# Altium schematic sheet Sheet1.SCHDOC
size 420 x 297 mm; SheetNumber: 1; SheetTotal: 1; Scale: 1:1; DocumentType: Схема электрическая принципиальная; FirstReferrence: АБВГ.123456.001; DocumentName: Sheet1.SCHDOC
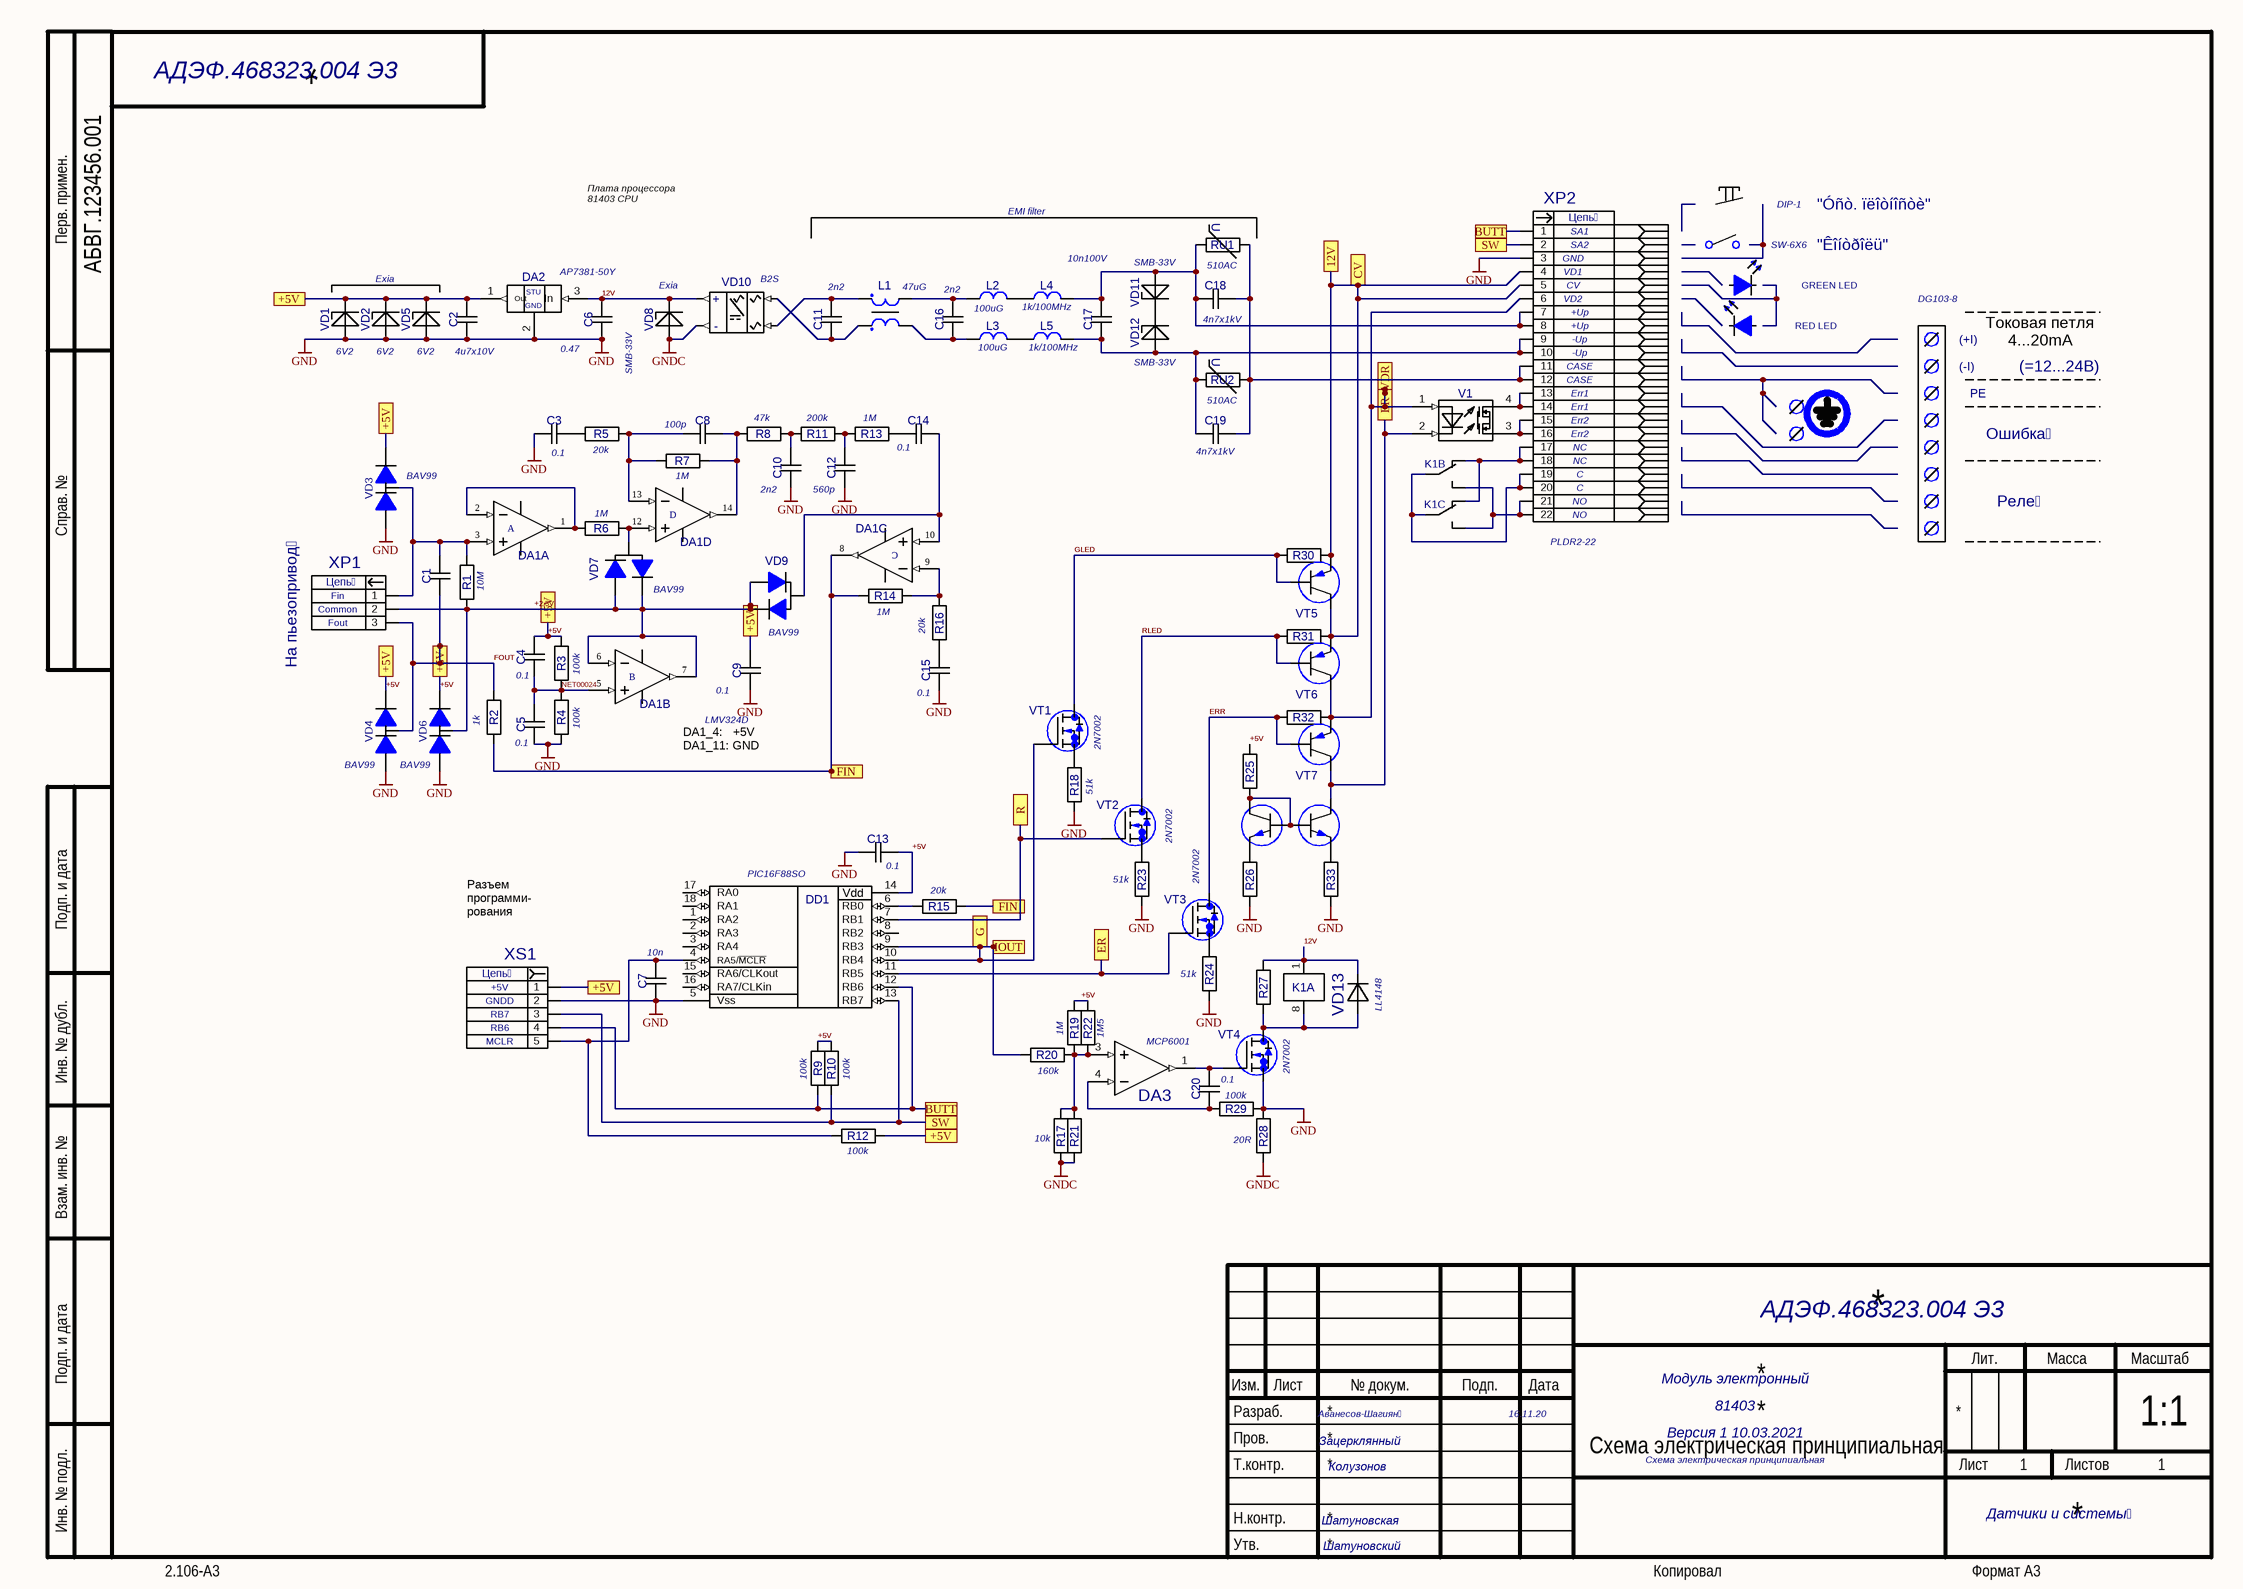
[diagram p0: Sheet1.SCHDOC]

## Parts
C1  CN0805  [0805]  (value not drawn)
C2  CN0805  [0805]  (value not drawn)
C3  CN0805  [0805]  (value not drawn)
C4  CN0805  [0805]  (value not drawn)
C5  CN0805  [0805]  (value not drawn)
C6  CN0805  [0805]  (value not drawn)
C7  CN0805  [0805]  (value not drawn)
C8  CN0805  [0805]  (value not drawn)
C9  CN0805  [0805]  (value not drawn)
C10  CN0805  [0805]  (value not drawn)
C11  CN0805  [0805]  (value not drawn)
C12  CN0805  [0805]  (value not drawn)
C13  CN0805  [0805]  (value not drawn)
C14  CN0805  [0805]  (value not drawn)
C15  CN0805  [0805]  (value not drawn)
C16  CN0805  [0805]  (value not drawn)
C17  CN0805  [0805]  (value not drawn)
C18  CN1210  [1210]  (value not drawn)
C19  CN1210  [1210]  (value not drawn)
C20  CN0805  [0805]  (value not drawn)
DA1  DA-OP-AD8544-SO14  [SO-G14]  (value not drawn)  (parts A,B,C,D of 4)
DA2  DA-STU-78LXXSOT89  [SOT89M]  (value not drawn)
DA3  DA-OP-AD8541-SOT23  [SOT23-(5)]  (value not drawn)
DD1  DD-CPU-PIC16F88SO  [SO18W]  (value not drawn)
K1  K-RELAY-UA2  [UB2]  (value not drawn)  (parts A,B,C of 3)
L1  L-SF0602  [SF0602]  (value not drawn)
L2  L-1210  [1210]  (value not drawn)
L3  L-1210  [1210]  (value not drawn)
L4  L-0805  [0805]  (value not drawn)
L5  L-0805  [0805]  (value not drawn)
R1  R1206  [1206]  (value not drawn)
R2  R1206  [1206]  (value not drawn)
R3  R1206  [1206]  (value not drawn)
R4  R1206  [1206]  (value not drawn)
R5  R1206  [1206]  (value not drawn)
R6  R1206  [1206]  (value not drawn)
R7  R1206  [1206]  (value not drawn)
R8  R1206  [1206]  (value not drawn)
R9  R1206  [1206]  (value not drawn)
R10  R1206  [1206]  (value not drawn)
R11  R1206  [1206]  (value not drawn)
R12  R1206  [1206]  (value not drawn)
R13  R1206  [1206]  (value not drawn)
R14  R1206  [1206]  (value not drawn)
R15  R1206  [1206]  (value not drawn)
R16  R1206  [1206]  (value not drawn)
R17  R1206  [1206]  (value not drawn)
R18  R1206  [1206]  (value not drawn)
R19  R1206  [1206]  (value not drawn)
R20  R1206  [1206]  (value not drawn)
R21  R1206  [1206]  (value not drawn)
R22  R1206  [1206]  (value not drawn)
R23  R1206  [1206]  (value not drawn)
R24  R1206  [1206]  (value not drawn)
R25  R1206  [1206]  (value not drawn)
R26  R1206  [1206]  (value not drawn)
R27  R1206  [1206]  (value not drawn)
R28  R1206  [1206]  (value not drawn)
R29  R1206  [1206]  (value not drawn)
R30  R1206  [1206]  (value not drawn)
R31  R1206  [1206]  (value not drawn)
R32  R1206  [1206]  (value not drawn)
R33  R1206  [1206]  (value not drawn)
RU1  RU-14D  [RU-14D]  (value not drawn)
RU2  RU-14D  [RU-14D]  (value not drawn)
V1  V-5P103V  [DIP_4_SMD]  (value not drawn)
VD1  VD-BZ-DO213AA  [DO-213AA]  (value not drawn)
VD2  VD-BZ-DO213AA  [DO-213AA]  (value not drawn)
VD3  VD-DIOD-BAV99V  [SOT23]  (value not drawn)
VD4  VD-DIOD-BAV99V  [SOT23]  (value not drawn)
VD5  VD-BZ-DO213AA  [DO-213AA]  (value not drawn)
VD6  VD-DIOD-BAV99V  [SOT23]  (value not drawn)
VD7  VD-DIOD-BAV99  [SOT23]  (value not drawn)
VD8  VD-BZ-DO214AA  [DO-214AA]  (value not drawn)
VD9  VD-DIOD-BAV99  [SOT23]  (value not drawn)
VD10  VD-B2S  [DIP_4_SMD_BXS]  (value not drawn)
VD11  VD-BZ-DO214AA  [DO-214AA]  (value not drawn)
VD12  VD-BZ-DO214AA  [DO-214AA]  (value not drawn)
VD13  VD-DIOD-SOD80  [SOD-80]  (value not drawn)
VT1  VT-MOSFET_N-SOT23  [SOT23]  (value not drawn)
VT2  VT-MOSFET_N-SOT23  [SOT23]  (value not drawn)
VT3  VT-MOSFET_N-SOT23  [SOT23]  (value not drawn)
VT4  VT-MOSFET_N-SOT23  [SOT23]  (value not drawn)
VT5  VT-PNP_SOT23  [SOT23]  (value not drawn)
VT6  VT-PNP_SOT23  [SOT23]  (value not drawn)
VT7  VT-PNP_SOT23  [SOT23]  (value not drawn)
VT8  VT-NPN_SOT23  [SOT23]  (value not drawn)
VT9  VT-NPN_SOT23  [SOT23]  (value not drawn)
XP1  XP-3-PLS-R  [PLS-3R]  (value not drawn)
XP2  XP-22-PLD2R  [PLD2-22R]  (value not drawn)
XS1  XS-5-PBS2  [PBS2-5]  (value not drawn)

## Ports
12V, +5V, BUTT, CV, ER, FIN, G, IOUT, R, SW, VDR

## Nets
+2,5V: C1.2 C2.1 C4.1 C9.1 C13.1 DA1.4(V+) DA1.6(IN-) DA1.7(OUT) DA2.1(Out) DA3.5(V+) DD1.14(Vdd) R1.1 R2.1 R3.2 R9.2 R10.2 R12.1 R19.1 R22.1 R25.1 VD1.2(K) VD2.2(K) VD3.2(K) VD4.2(K) VD4.3(K/A) VD5.2(K) VD6.2(K) VD6.3(K/A) VD7.1(A) VD7.2(K) VD9.1(A) VD9.2(K) XP1.2 XP1.3 XS1.1 ; port +5V  [also labelled +5V, FOUT]
GND: C2.2 C3.2 C5.2 C6.2 C7.2 C9.2 C10.2 C12.2 C13.2 C15.2 DA1.11(V-) DA2.2(GND) DA2.4(GND) DA3.2(V-) DD1.5(Vss) R4.1 R18.2 R23.2 R24.2 R26.2 R28.1 R29.1 R33.2 VD1.1(A) VD2.1(A) VD3.1(A) VD4.1(A) VD5.1(A) VD6.1(A) VT4.2(Source) XP2.3 XS1.2
GNDC: R17.2 R21.2 R28.2 VD8.1(A) VD10.4(-V)
12V: C6.1 DA2.3(In) K1.1 R27.1 VD8.2(K) VD10.3(+V) VD13.2(K)
12V: R30.2 R31.2 VT5.2(k) VT5.3(b) VT6.2(k) XP2.4 XP2.5 ; port CV, port 12V  [a separate net that carries the same name]
BUTT: DD1.12(RB6) R9.1 XP2.1 XS1.4 ; port BUTT
ER: DD1.11(RB5) V1.2(INI-) VT3.1(Gait) VT7.3(b) VT8.3(B) ; port ER
ERR: R32.1 VT3.3(drain) VT7.1(e)
FIN: DA1.8(OUT) R2.2 R14.2 R15.2 ; port FIN
G: DD1.9(RB3) DD1.10(RB4) R20.2 VT1.1(Gait) ; port IOUT, port G
GLED: R30.1 VT1.3(drain) VT5.1(e)
NET00024: C4.2 C5.1 DA1.5(IN+) R3.1 R4.2
R: DD1.7(RB1) VT2.1(Gait) ; port R
RLED: R31.1 VT2.3(drain) VT6.1(e)
SW: DD1.13(RB7) R10.1 XP2.2 XS1.3 ; port SW
VDR: R32.2 V1.1(INI+) VT6.3(b) VT7.2(k) XP2.6 ; port VDR
NetC1_1: C1.1 DA1.3(IN+) R1.2 VD3.3(K/A) XP1.1
NetC3_1: C3.1 R5.2
NetC7_1: C7.1 DD1.4(RA5/~{MCLR}) R12.2 XS1.5
NetC8_1: C8.1 DA1.14(OUT) R7.1 R8.2
NetC8_2: C8.2 DA1.13(IN-) R5.1 R7.2
NetC10_1: C10.1 R8.1 R11.2
NetC11_1: C11.1 L1.1 VD10.1
NetC11_2: C11.2 L1.2 VD10.2
NetC12_1: C12.1 R11.1 R13.2
NetC14_1: C14.1 DA1.10(IN+) VD9.3(K/A)
NetC14_2: C14.2 R13.1
NetC15_1: C15.1 R16.2
NetC16_1: C16.1 L1.4 L2.1
NetC16_2: C16.2 L1.3 L3.1
NetC17_1: C17.1 C18.2 L4.2 RU1.2 VD11.1(A) XP2.7 XP2.8
NetC17_2: C17.2 C19.2 L5.2 RU2.2 VD12.1(A) XP2.9 XP2.10
NetC18_1: C18.1 C19.1 RU1.1 RU2.1 XP2.11 XP2.12
NetC20_1: C20.1 DA3.1(out) VT4.1(Gait)
NetC20_2: C20.2 DA3.4(-in) R29.2
NetDA1_1: DA1.1(OUT) DA1.2(IN-) R6.2
NetDA1_9: DA1.9(IN-) R14.1 R16.1
NetDA1_12: DA1.12(IN+) R6.1 VD7.3(K/A)
NetDA3_3: DA3.3(+in) R17.1 R19.2 R20.1 R21.1 R22.2
NetDD1_6: DD1.6(RB0) R15.1
NetK1_2: K1.2 K1.7 XP2.17 XP2.18
NetK1_3: K1.3 K1.6 XP2.19 XP2.20
NetK1_4: K1.4 K1.5 XP2.21 XP2.22
NetK1_8: K1.8 R27.2 VD13.1(A) VT4.3(drain)
NetL2_2: L2.2 L4.1
NetL3_2: L3.2 L5.1
NetR18_1: R18.1 VT1.2(Source)
NetR23_1: R23.1 VT2.2(Source)
NetR24_1: R24.1 VT3.2(Source)
NetR25_2: R25.2 VT8.1(E) VT9.1(E) VT9.3(B)
NetR26_1: R26.1 VT9.2(K)
NetR33_1: R33.1 VT8.2(K)
NetV1_3: V1.3(OUT) XP2.15 XP2.16
NetV1_4: V1.4(OUT) XP2.13 XP2.14
NetVD11_2: VD11.2(K) VD12.2(K)

Not connected (* = marked no-connect by the designer): DD1 1(RA2) 2(RA3) 3(RA4) 8(RB2) 15(RA6/CLKout) 16(RA7/CLKin) 17(RA0) 18(RA1)

## Notes on the sheet
- АДЭФ.468323.004 Э3
- Плата процессора
  81403 CPU
- EMI filter
- 10n100V
- (near VD11) SMB-33V
- (near RU1) 510AC
- (near XP2) GND
- (near XP2) SA2
- (near XP2) SA1
- SW-6X6
- DIP-1
- "Êîíòðîëü"
- "Óñò. ïëîòíîñòè"
- Exia
- AP7381-50Y
- (near VD10) B2S
- 2n2
- (near L1) 47uG
- (near L2) 100uG
- (near L4) 1k/100MHz
- (near C18) 4n7x1kV
- (near XP2) CV
- (near XP2) VD2
- (near XP2) VD1
- (near XP2) +Up
- RED LED
- GREEN LED
- DG103-8
- (near VD1) 6V2
- (near VD2) 6V2
- (near VD5) 6V2
- (near C2) 4u7x10V
- 0.47
- SMB-33V
- (near L3) 100uG
- (near L5) 1k/100MHz
- (near VD12) SMB-33V
- (near RU2) 510AC
- (near XP2) CASE
- (near XP2) -Up
- (near XP2) Err1
- (-I)
- (+I)
- PE
- Токовая петля
  4...20mA
- (=12...24В)
- 0.1
- (near R5) 20k
- (near C8) 100p
- (near R8) 47k
- (near R11) 200k
- (near R13) 1M
- (near C19) 4n7x1kV
- (near XP2) NC
- (near XP2) Err2
- Ошибка
- (near VD3) BAV99
- (near R6) 1M
- (near R7) 1M
- (near C10) 2n2
- (near C12) 560p
- (near XP2) C
- (near XP2) NO
- Реле
- На пьезопривод
- (near XP1) Fin
- (near R1) 10M
- (near VD7) BAV99
- (near XP2) PLDR2-22
- (near XP1) Fout
- (near XP1) Common
- (near R3) 100k
- (near VD9) BAV99
- (near R14) 1M
- (near R16) 20k
- (near R2) 1k
- (near C4) 0.1
- (near R4) 100k
- (near C9) 0.1
- LMV324D
- (near C15) 0.1
- 2N7002
- (near VD4) BAV99
- BAV99
- (near C5) 0.1
- DA1_4:   +5V
  DA1_11: GND
- (near R18) 51k
- (near DD1) PIC16F88SO
- (near C13) 0.1
- (near VT3) 2N7002
- (near XS1) Разъем
  программи-
  рования
- (near R15) 20k
- (near R23) 51k
- (near XS1) +5V
- (near XS1) GNDD
- (near C7) 10n
- (near R24) 51k
- (near VD13) LL4148
- (near XS1) RB7
- (near XS1) RB6
- (near XS1) MCLR
- (near R9) 100k
- (near R10) 100k
- (near R20) 160k
- (near R19) 1M
- (near R22) 1M5
- (near DA3) MCP6001
- (near VT4) 2N7002
- (near R17) 10k
- (near R29) 100k
- (near R28) 20R
- (near R12) 100k
- Аванесов-Шагиян
- 16.11.20
- 81403
- Модуль электронный
- Колузонов
- Зацерклянный
- Схема электрическая принципиальная
- Версия 1 10.03.2021
- Шатуновская
- Шатуновский
- Датчики и системы
- Перв. примен.
- Справ. №
- Подп. и дата
- Инв. № дубл.
- Взам. инв. №
- Разраб.
- Изм.
- Лист
- № докум.
- Подп.
- Дата
- Лит.
- Масса
- Масштаб
- Пров.
- Т.контр.
- Листов
- Инв. № подл.
- Утв.
- Н.контр.
- 2.106-A3
- Копировал
- Формат А3
- (in symbol DA-OP-AD8544-SO14, part A) A
- (in symbol DA-OP-AD8544-SO14, part B) B
- (in symbol DA-OP-AD8544-SO14, part C) C
- (in symbol DA-OP-AD8544-SO14, part D) D
- (in symbol DA-STU-78LXXSOT89) STU
- (in symbol RU-14D) U
- (in symbol VD-B2S) +; -
- (in symbol XP-3-PLS-R) Цепь
- (in symbol XP-22-PLD2R) Цепь
- (in symbol XS-5-PBS2) Цепь

## Library data of the parts
C2 = CN0805: Value: 4u7x10V
C3-C5 C9 C13-C15 C20 = CN0805: Value: 0.1
C6 = CN0805: Value: 0.47
C7 = CN0805: Value: 10n
C8 = CN0805: Value: 100p
C10 C11 C16 = CN0805: Value: 2n2
C12 = CN0805: Value: 560p
C17 = CN0805: Value: 10n100V
C18 C19 = CN1210: Value: 4n7x1kV
DA1 = DA-OP-AD8544-SO14: Micropower Single-Supply Rail-to-Rail Input/Output Operational Amplifier; Value: LMV324D; OriginalName: OP491GS; ComponentField6: Published 8-Jun-2000
DA2 = DA-STU-78LXXSOT89: Value: AP7381-50Y
DA3 = DA-OP-AD8541-SOT23: Value: MCP6001; OriginalName: AD8531AR; ComponentField7: Published 8-Jun-2000, Modified 10-July-2000: SIM Model Added.; ComponentField6: Pin 8 is not connected. Parameters RG and RB are not available in SPICE. As a result simulation generates an error, however output correct.
L1 = L-SF0602: Value: 47uG
L2 L3 = L-1210: Value: 100uG
L4 L5 = L-0805: Value: 1k/100MHz
R1 = R1206: Value: 10M
R2 R27 = R1206: Value: 1k
R3 R4 R9 R10 R12 R29 = R1206: Value: 100k
R5 R15 R16 R30-R32 = R1206: Value: 20k
R6 R7 R13 R14 R19 = R1206: Value: 1M
R8 = R1206: Value: 47k
R11 = R1206: Value: 200k
R17 = R1206: Value: 10k
R18 R23-R26 R33 = R1206: Value: 51k
R20 = R1206: Value: 160k
R22 = R1206: Value: 1M5
R28 = R1206: Value: 20R
RU1 RU2 = RU-14D: Value: 510AC
VD1 VD2 VD5 = VD-BZ-DO213AA: Value: 6V2
VD3 = VD-DIOD-BAV99V: Value: BAV99V
VD4 VD6 = VD-DIOD-BAV99V: Value: BAV99
VD7 VD9 = VD-DIOD-BAV99: Value: BAV99
VD8 = VD-BZ-DO214AA: Value: 33V
VD10 = VD-B2S: Value: B2S
VD11 VD12 = VD-BZ-DO214AA: Value: SMB-33V
VD13 = VD-DIOD-SOD80: Value: LL4148
VT1-VT4 = VT-MOSFET_N-SOT23: Value: 2N7002
XP1 = XP-3-PLS-R: Value: PLS3-R
XP2 = XP-22-PLD2R: Value: PLD2-20
DD1 = DD-CPU-PIC16F88SO: Value: PIC16F88SO
K1 = K-RELAY-UA2: Value: *
V1 = V-5P103V: Value: *
XS1 = XS-5-PBS2: Value: *